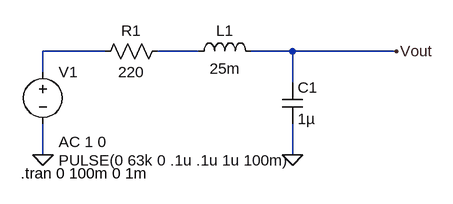
[diagram p0: schematic Lab1_3.asc]
Lab1_3.asc, the LTspice schematic file:
Version 4
SHEET 1 880 680
WIRE 128 96 32 96
WIRE 272 96 208 96
WIRE 416 96 352 96
WIRE 576 96 416 96
WIRE 32 128 32 96
WIRE 416 144 416 96
WIRE 32 256 32 208
WIRE 416 256 416 208
FLAG 32 256 0
FLAG 416 256 0
FLAG 576 96 Vout
SYMBOL voltage 32 112 R0
WINDOW 3 24 152 Left 2
WINDOW 123 24 124 Left 2
WINDOW 39 0 0 Left 0
SYMATTR InstName V1
SYMATTR Value PULSE(0 63k 0 .1u .1u 1u 100m)
SYMATTR Value2 AC 1 0
SYMBOL res 224 80 R90
WINDOW 0 0 56 VBottom 2
WINDOW 3 32 56 VTop 2
SYMATTR InstName R1
SYMATTR Value 220
SYMBOL ind 256 112 R270
WINDOW 0 32 56 VTop 2
WINDOW 3 5 56 VBottom 2
SYMATTR InstName L1
SYMATTR Value 25m
SYMBOL cap 400 144 R0
SYMATTR InstName C1
SYMATTR Value 1µ
TEXT -2 284 Left 2 !.tran 0 100m 0 1m

The netlist it stands for:
* Lab1_3.asc
V1 N001 0 PULSE(0 63k 0 .1u .1u 1u 100m) AC 1 0
R1 N002 N001 220
L1 N002 Vout 25m
C1 Vout 0 1µ
.tran 0 100m 0 1m
.backanno
.end